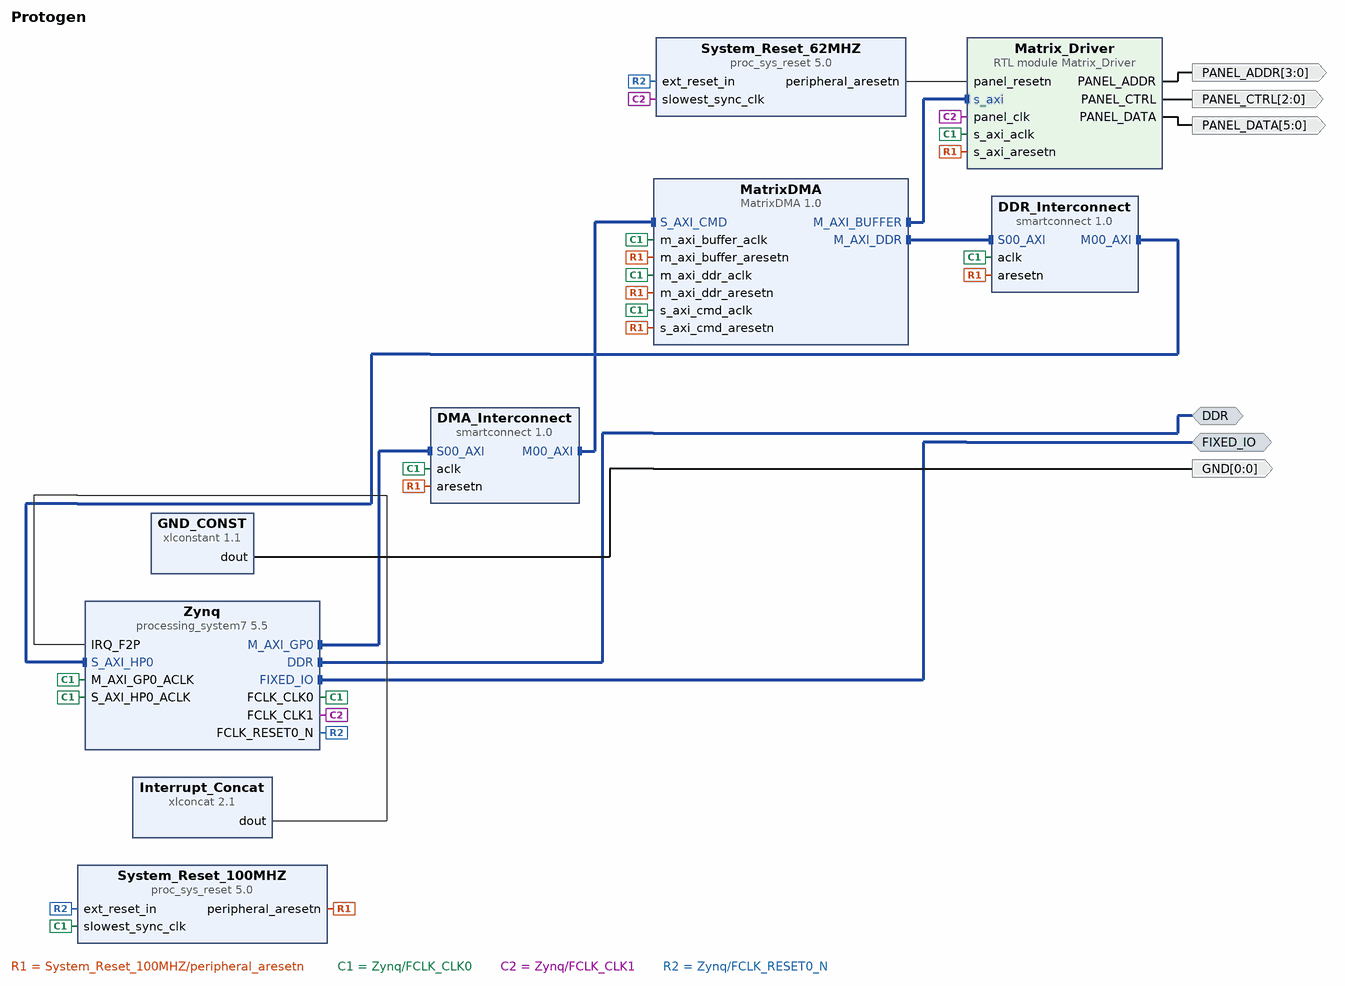
[diagram p0: block diagram of the top level]
# Vivado block design Protogen, xc7z020clg400-1, Vivado 2021.2.1
create_bd_design Protogen

create_bd_intf_port -mode Master -vlnv xilinx.com:interface:ddrx_rtl:1.0 DDR
create_bd_intf_port -mode Master -vlnv xilinx.com:display_processing_system7:fixedio_rtl:1.0 FIXED_IO
create_bd_port -dir O -from 5 -to 0 PANEL_DATA
create_bd_port -dir O -from 3 -to 0 PANEL_ADDR
create_bd_port -dir O -from 2 -to 0 PANEL_CTRL
create_bd_port -dir O -from 0 -to 0 GND

create_bd_cell -type ip -vlnv xilinx.com:ip:xlconstant:1.1 GND_CONST
set_property -dict {CONFIG.CONST_VAL 0} [get_bd_cells GND_CONST]
create_bd_cell -type ip -vlnv xilinx.com:ip:xlconcat:2.1 Interrupt_Concat
set_property -dict {CONFIG.NUM_PORTS 2} [get_bd_cells Interrupt_Concat]
create_bd_cell -type ip -vlnv xilinx.com:ip:processing_system7:5.5 Zynq
set_property -dict [list \
  CONFIG.PCW_APU_PERIPHERAL_FREQMHZ 667 \
  CONFIG.PCW_ENET0_ENET0_IO {MIO 16 .. 27} \
  CONFIG.PCW_ENET0_GRP_MDIO_ENABLE 1 \
  CONFIG.PCW_ENET0_GRP_MDIO_IO {MIO 52 .. 53} \
  CONFIG.PCW_ENET0_PERIPHERAL_ENABLE 1 \
  CONFIG.PCW_ENET0_RESET_ENABLE 0 \
  CONFIG.PCW_ENET_RESET_ENABLE 1 \
  CONFIG.PCW_ENET_RESET_SELECT {Share reset pin} \
  CONFIG.PCW_EN_CLK1_PORT 1 \
  CONFIG.PCW_FCLK_CLK0_BUF FALSE \
  CONFIG.PCW_FPGA0_PERIPHERAL_FREQMHZ 100 \
  CONFIG.PCW_FPGA1_PERIPHERAL_FREQMHZ 62.5 \
  CONFIG.PCW_FPGA2_PERIPHERAL_FREQMHZ 250 \
  CONFIG.PCW_FPGA3_PERIPHERAL_FREQMHZ 12 \
  CONFIG.PCW_FPGA_FCLK1_ENABLE 1 \
  CONFIG.PCW_GPIO_MIO_GPIO_ENABLE 1 \
  CONFIG.PCW_GPIO_MIO_GPIO_IO MIO \
  CONFIG.PCW_GPIO_PERIPHERAL_ENABLE 1 \
  CONFIG.PCW_I2C_RESET_ENABLE 0 \
  CONFIG.PCW_IRQ_F2P_INTR 1 \
  CONFIG.PCW_PERIPHERAL_BOARD_PRESET part0 \
  CONFIG.PCW_PRESET_BANK1_VOLTAGE {LVCMOS 1.8V} \
  CONFIG.PCW_QSPI_GRP_FBCLK_ENABLE 1 \
  CONFIG.PCW_QSPI_GRP_FBCLK_IO {MIO 8} \
  CONFIG.PCW_QSPI_GRP_SINGLE_SS_ENABLE 1 \
  CONFIG.PCW_QSPI_GRP_SINGLE_SS_IO {MIO 1 .. 6} \
  CONFIG.PCW_QSPI_PERIPHERAL_ENABLE 1 \
  CONFIG.PCW_QSPI_QSPI_IO {MIO 1 .. 6} \
  CONFIG.PCW_SD0_GRP_CD_ENABLE 1 \
  CONFIG.PCW_SD0_GRP_CD_IO {MIO 46} \
  CONFIG.PCW_SD0_GRP_WP_ENABLE 1 \
  CONFIG.PCW_SD0_GRP_WP_IO {MIO 50} \
  CONFIG.PCW_SD0_PERIPHERAL_ENABLE 1 \
  CONFIG.PCW_SD0_SD0_IO {MIO 40 .. 45} \
  CONFIG.PCW_SDIO_PERIPHERAL_FREQMHZ 25 \
  CONFIG.PCW_SINGLE_QSPI_DATA_MODE x4 \
  CONFIG.PCW_UART0_PERIPHERAL_ENABLE 1 \
  CONFIG.PCW_UART0_UART0_IO EMIO \
  CONFIG.PCW_UART1_PERIPHERAL_ENABLE 1 \
  CONFIG.PCW_UART1_UART1_IO {MIO 48 .. 49} \
  CONFIG.PCW_UART_PERIPHERAL_FREQMHZ 50 \
  CONFIG.PCW_UIPARAM_DDR_FREQ_MHZ 533.333333 \
  CONFIG.PCW_UIPARAM_DDR_PARTNO {MT41K256M16 RE-125} \
  CONFIG.PCW_USB0_PERIPHERAL_ENABLE 1 \
  CONFIG.PCW_USB0_RESET_ENABLE 1 \
  CONFIG.PCW_USB0_RESET_IO {MIO 7} \
  CONFIG.PCW_USB0_USB0_IO {MIO 28 .. 39} \
  CONFIG.PCW_USB_RESET_ENABLE 1 \
  CONFIG.PCW_USB_RESET_SELECT {Share reset pin} \
  CONFIG.PCW_USE_AXI_NONSECURE 1 \
  CONFIG.PCW_USE_FABRIC_INTERRUPT 1 \
  CONFIG.PCW_USE_S_AXI_HP0 1 \
] [get_bd_cells Zynq]
# 512 more settings of Zynq are not shown: defaults, MIO pin electricals, DDR timing, and values the tool derives
create_bd_cell -type ip -vlnv xilinx.com:ip:smartconnect:1.0 DMA_Interconnect
set_property -dict {CONFIG.NUM_SI 1} [get_bd_cells DMA_Interconnect]
create_bd_cell -type ip -vlnv xilinx.com:ip:smartconnect:1.0 DDR_Interconnect
set_property -dict {CONFIG.NUM_SI 1} [get_bd_cells DDR_Interconnect]
create_bd_cell -type ip -vlnv xilinx.com:ip:proc_sys_reset:5.0 System_Reset_100MHZ
create_bd_cell -type ip -vlnv xilinx.com:ip:proc_sys_reset:5.0 System_Reset_62MHZ
create_bd_cell -type module -reference Matrix_Driver Matrix_Driver
create_bd_cell -type ip -vlnv xilinx.com:user:MatrixDMA:1.0 MatrixDMA

# ---- connections ----

connect_bd_intf_net [get_bd_intf_pins DDR_Interconnect/M00_AXI] [get_bd_intf_pins Zynq/S_AXI_HP0]
connect_bd_intf_net [get_bd_intf_pins DMA_Interconnect/M00_AXI] [get_bd_intf_pins MatrixDMA/S_AXI_CMD]
connect_bd_intf_net -intf_net MatrixDMA_0_M_AXI_BUFFER [get_bd_intf_pins MatrixDMA/M_AXI_BUFFER] [get_bd_intf_pins Matrix_Driver/s_axi]
connect_bd_intf_net -intf_net MatrixDMA_0_M_AXI_DDR [get_bd_intf_pins MatrixDMA/M_AXI_DDR] [get_bd_intf_pins DDR_Interconnect/S00_AXI]
connect_bd_intf_net [get_bd_intf_pins DMA_Interconnect/S00_AXI] [get_bd_intf_pins Zynq/M_AXI_GP0]
connect_bd_intf_net -intf_net processing_system7_0_DDR [get_bd_intf_ports DDR] [get_bd_intf_pins Zynq/DDR]
connect_bd_intf_net -intf_net processing_system7_0_FIXED_IO [get_bd_intf_ports FIXED_IO] [get_bd_intf_pins Zynq/FIXED_IO]
connect_bd_net [get_bd_pins Matrix_Driver/PANEL_ADDR] [get_bd_ports PANEL_ADDR]
connect_bd_net [get_bd_pins Matrix_Driver/PANEL_CTRL] [get_bd_ports PANEL_CTRL]
connect_bd_net [get_bd_pins Matrix_Driver/PANEL_DATA] [get_bd_ports PANEL_DATA]
connect_bd_net [get_bd_pins System_Reset_100MHZ/peripheral_aresetn] \
  [get_bd_pins DMA_Interconnect/aresetn] [get_bd_pins DDR_Interconnect/aresetn] [get_bd_pins Matrix_Driver/s_axi_aresetn] \
  [get_bd_pins MatrixDMA/m_axi_buffer_aresetn] [get_bd_pins MatrixDMA/m_axi_ddr_aresetn] \
  [get_bd_pins MatrixDMA/s_axi_cmd_aresetn]
connect_bd_net [get_bd_pins System_Reset_62MHZ/peripheral_aresetn] [get_bd_pins Matrix_Driver/panel_resetn]
connect_bd_net [get_bd_pins Zynq/FCLK_CLK0] \
  [get_bd_pins Matrix_Driver/s_axi_aclk] [get_bd_pins Zynq/M_AXI_GP0_ACLK] [get_bd_pins Zynq/S_AXI_HP0_ACLK] \
  [get_bd_pins DMA_Interconnect/aclk] [get_bd_pins DDR_Interconnect/aclk] [get_bd_pins System_Reset_100MHZ/slowest_sync_clk] \
  [get_bd_pins MatrixDMA/m_axi_buffer_aclk] [get_bd_pins MatrixDMA/m_axi_ddr_aclk] [get_bd_pins MatrixDMA/s_axi_cmd_aclk]
connect_bd_net [get_bd_pins Zynq/FCLK_CLK1] [get_bd_pins Matrix_Driver/panel_clk] [get_bd_pins System_Reset_62MHZ/slowest_sync_clk]
connect_bd_net [get_bd_pins Zynq/FCLK_RESET0_N] [get_bd_pins System_Reset_100MHZ/ext_reset_in] [get_bd_pins System_Reset_62MHZ/ext_reset_in]
connect_bd_net -net xlconcat_0_dout [get_bd_pins Interrupt_Concat/dout] [get_bd_pins Zynq/IRQ_F2P]
connect_bd_net -net xlconstant_0_dout [get_bd_pins GND_CONST/dout] [get_bd_ports GND]

# ---- address map ----
assign_bd_address -offset 0x00000000 -range 4G -target_address_space [get_bd_addr_spaces MatrixDMA/M_AXI_BUFFER] [get_bd_addr_segs Matrix_Driver/s_axi/reg0]
assign_bd_address -offset 0x00000000 -range 1G -target_address_space [get_bd_addr_spaces MatrixDMA/M_AXI_DDR] [get_bd_addr_segs Zynq/S_AXI_HP0/HP0_DDR_LOWOCM]
assign_bd_address -offset 0x43C00000 -range 64K -target_address_space [get_bd_addr_spaces Zynq/Data] [get_bd_addr_segs MatrixDMA/S_AXI_CMD/S_AXI_CMD_reg]

validate_bd_design
save_bd_design
